# EAGLE design RLY_INVERTER (EAGLE 9.2.1)
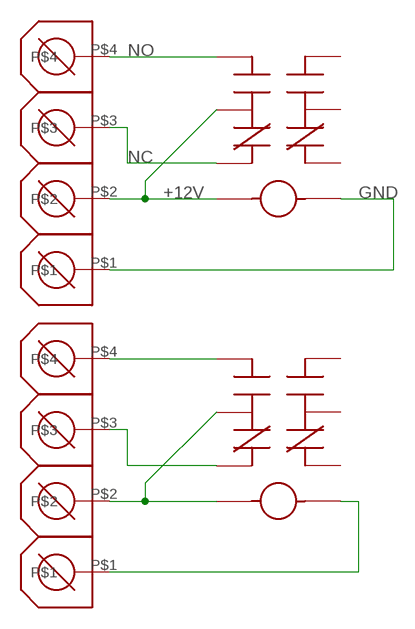
[diagram p0: schematic, sheet 1]

## Parts
J1  TE_282834-4  [282834-4_FOOT]
J2  TE_282834-4  [282834-4_FOOT]
U$1  BSPD_PARTS_RLY_V23079A1001B301  [BSPD_PARTS_V23079F1101B301]
U$2  BSPD_PARTS_RLY_V23079A1001B301  [BSPD_PARTS_V23079F1101B301]

## Nets
+12V: J2.P$2 U$2.1 U$2.4
GND: J2.P$1 U$2.12
N$1: J1.P$1 U$1.12
N$2: J1.P$2 U$1.1 U$1.4
N$4: J1.P$4 U$1.5
N$5: J1.P$3 U$1.3
NC: J2.P$3 U$2.3
NO: J2.P$4 U$2.5
Unconnected: U$1.8 U$1.9 U$1.10 U$2.8 U$2.9 U$2.10

## Library data of the parts
J1 J2 = 111_Custom:TE_282834-4
U$1 U$2 = BSPD_v4:BSPD_PARTS_RLY_V23079A1001B301

## Net classes
0 default: width 1.5 mm, clearance 0.2 mm

## Board
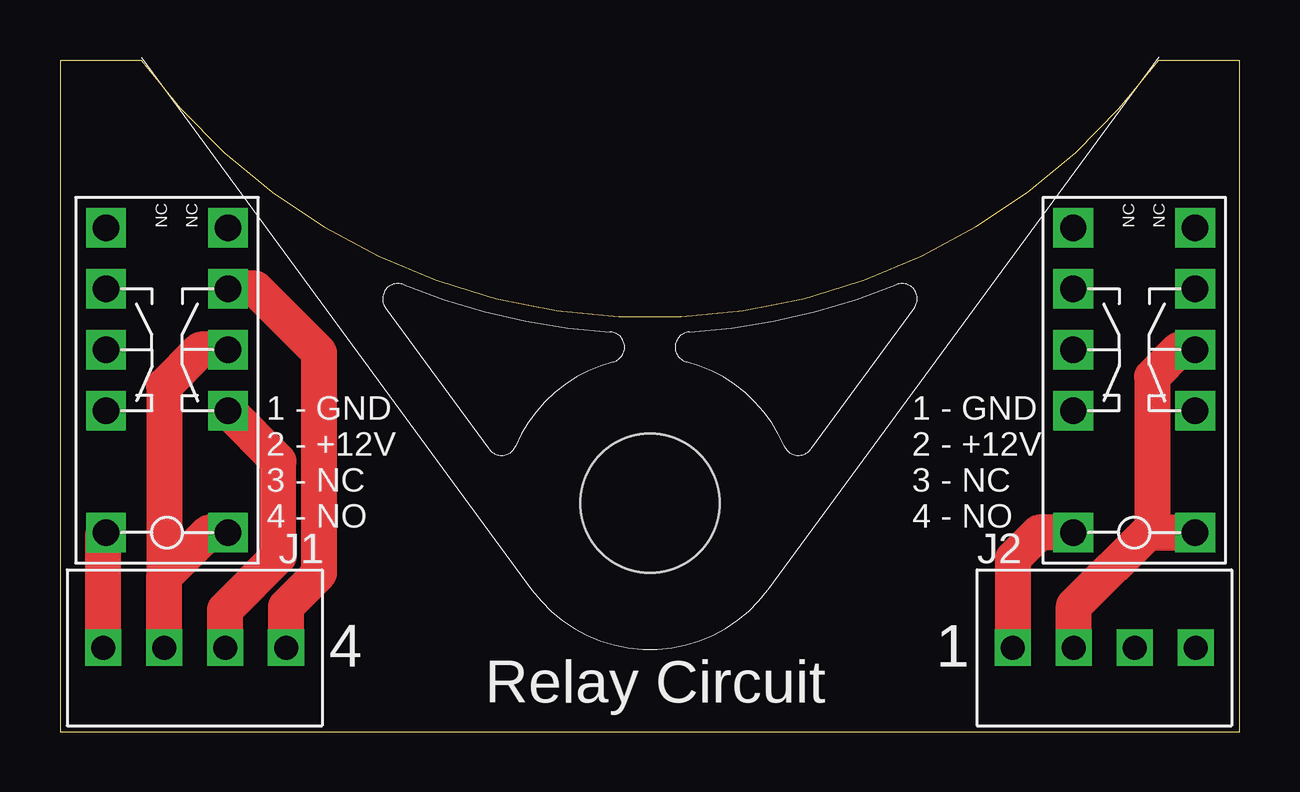
[diagram p1: board, top side]
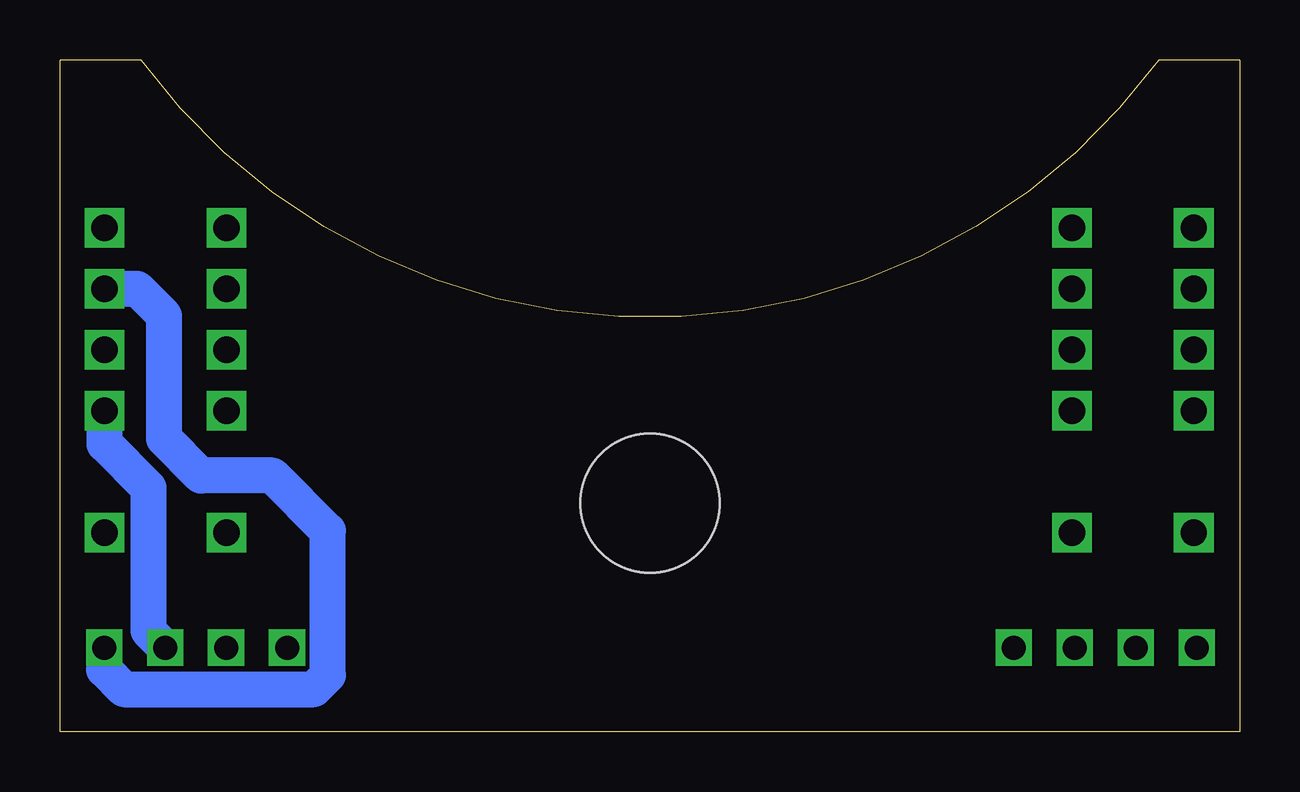
[diagram p2: board, bottom side, seen from below]

Size 49.16 x 28 mm. Coordinates in mm from the lower left corner, seen from the top.
Outline: 0,0 49.16,0 49.16,28 45.78,28 arc-107 3.38,28 0,28 0,0
Copper layers (1*16): Top 0.035mm / dielectric 1.5mm / Bottom 0.035mm
Design rules "default": minimum track width 6mil, minimum drill 0.35mm, track to track 6mil, track to pad 6mil, pad to pad 6mil, via to via 6mil, smd to smd 6mil, copper to edge 40mil, drill to drill 6mil, minimum pad ring 10mil, minimum via ring 8mil, stop-mask expansion 4mil, vias tented up to drill 0mil, thermal gap 10mil
Holes 5.8 mm at 24.58,9.52

### Footprints (pad centres in the part's own frame; a part is rotated, then mirrored left to right if it is on the bottom)
282834-4_FOOT = drill 1 square: P$1 0,0; P$2 2.54,0; P$3 5.08,0; P$4 7.62,0
BSPD_PARTS_V23079F1101B301 = drill 1.1 square: 1 0,0; 3 5.08,0; 4 7.62,0; 5 10.16,0; 6 12.7,0; 7 12.7,5.08; 8 10.16,5.08; 9 7.62,5.08; 10 5.08,5.08; 12 0,5.08

### Placement (x,y rotation side)
J1  1.8,3.5 0 top
J2  39.7,3.5 0 top
U$1  7,8.3 90 top
U$2  47.3,8.3 90 top

### Tracks (layer width: path | path; a pad name or v marks a point on that pad's centre or on a via)
+12V
  Top 1.5: J2.P$2 42.24,5.24 45.5,8.5 | U$2.1 45.5,8.3 45.5,8.5 | U$2.4 46.62,15.92 45.5,14.8 45.5,8.5
GND
  Top 1.5: U$2.12 40.8,8.3 39.7,7.2 J2.P$1
N$1
  Top 1.5: J1.P$1 1.8,8.18 U$1.12
N$2
  Top 1.5: J1.P$2 4.34,6.44 | 4.34,6.44 6.2,8.3 U$1.1 | U$1.4 5.85,15.92 4.34,14.41 4.34,6.44
N$4
  Top 1.5: J1.P$4 9.42,5.22 10.8,6.6 10.8,15.8 8.14,18.46 U$1.5
N$5
  Top 1.5: J1.P$3 6.88,5.08 9.1,7.3 9.1,11.28 U$1.3
NC
  Bottom 1.5: J2.P$3 45.48,4.2 45.48,10.16 47.3,11.98 U$2.3
NO
  Bottom 1.5: U$2.5 45.95,18.46 44.83,17.34 44.83,12.21 43.29,10.68 40.3,10.68 38,8.37 38,2.35 38.58,1.77 46.5,1.77 47.32,2.59 J2.P$4

### Text on the board
tPlace: 1 - GND / 2 - +12V / 3 - NC / 4 - NO | 1 - GND / 2 - +12V / 3 - NC / 4 - NO | 4 | 1 | Relay Circuit